# Altium project MAX-F10S-00B Breakout V1.PrjPcb
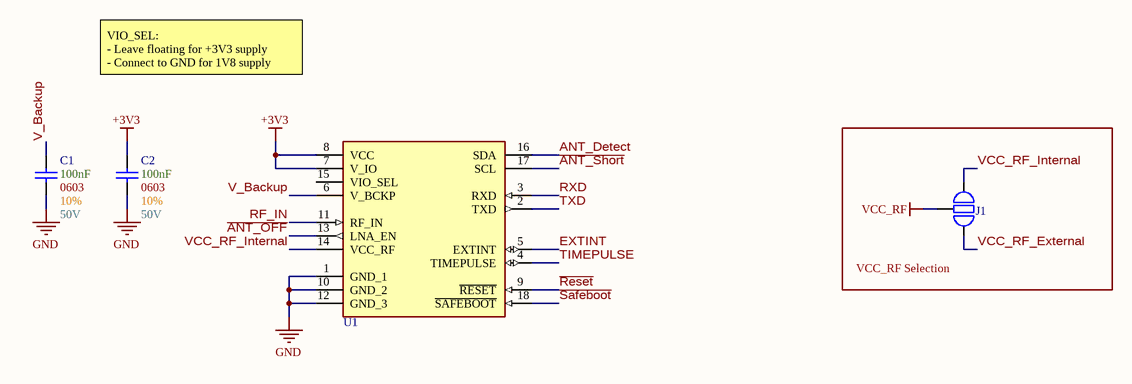
[diagram p0: Main.SchDoc]
3 sheets, 25 parts. Net scope: global (net labels, ports and power ports of the same name join across sheets).
Board file: Layout.PcbDoc
Sheets:
  Main.SchDoc
  Antenna Supervisory Circuit.SchDoc
  Power.SchDoc

## Sheet Main.SchDoc
size A; SheetNumber: 1; SheetTotal: 4

### Parts
C1  Max Voltage: 50V  Size Package: 0603  Tolerance: 10%  Capacitance: 100nF  [[Cap] SMD 0603]  (hidden comment: [Cap] 0603 0.1uF 10% 50V)
C2  Max Voltage: 50V  Size Package: 0603  Tolerance: 10%  Capacitance: 100nF  [[Cap] SMD 0603]  (hidden comment: [Cap] 0603 0.1uF 10% 50V)
J1  [Jumper] Thru-Hole 3pin  [[Jumper] Thru-Hole 3pin]  (value not drawn)  (no BOM)
U1  Dual-Band GNSS Module  [[GNSS] MAX-F10S-00B]  (value not drawn)

### Blocks framed on the sheet
VCC_RF Selection: J1

### Nets
+3V3: C2.2 U1.7(V_IO) U1.8(VCC)
GND: C1.1 C2.1 U1.1(GND_1) U1.10(GND_2) U1.12(GND_3)
RF_IN: U1.11(RF_IN)
VCC_RF: J1.2(Common)
~{ANT_OFF}: U1.13(LNA_EN)
~{ANT_Short}: U1.17(SCL)
~{Reset}: U1.9(~{RESET})
~{Safeboot}: U1.18(~{SAFEBOOT})
ANT_Detect: U1.16(SDA)
EXTINT: U1.5(EXTINT)
RXD: U1.3(RXD)
TIMEPULSE: U1.4(TIMEPULSE)
TXD: U1.2(TXD)
V_Backup: C1.2 U1.6(V_BCKP)
VCC_RF_External: J1.3
VCC_RF_Internal: J1.1 U1.14(VCC_RF)

Not connected (* = marked no-connect by the designer): U1 15(VIO_SEL)

### Notes on the sheet
- VIO_SEL:
  - Leave floating for +3V3 supply
  - Connect to GND for 1V8 supply

### Library data of the parts
C1 C2 = [Cap] 0603 0.1uF 10% 50V: CL10B104KB8NNNC; Supplier 1: DigiKey; Supplier Part Number 1: 1276-1000-6-ND
U1 = [GNSS] MAX-F10S-00B: MAX-F10S-00B

## Sheet Antenna Supervisory Circuit.SchDoc
size A; SheetNumber: 2; SheetTotal: 4
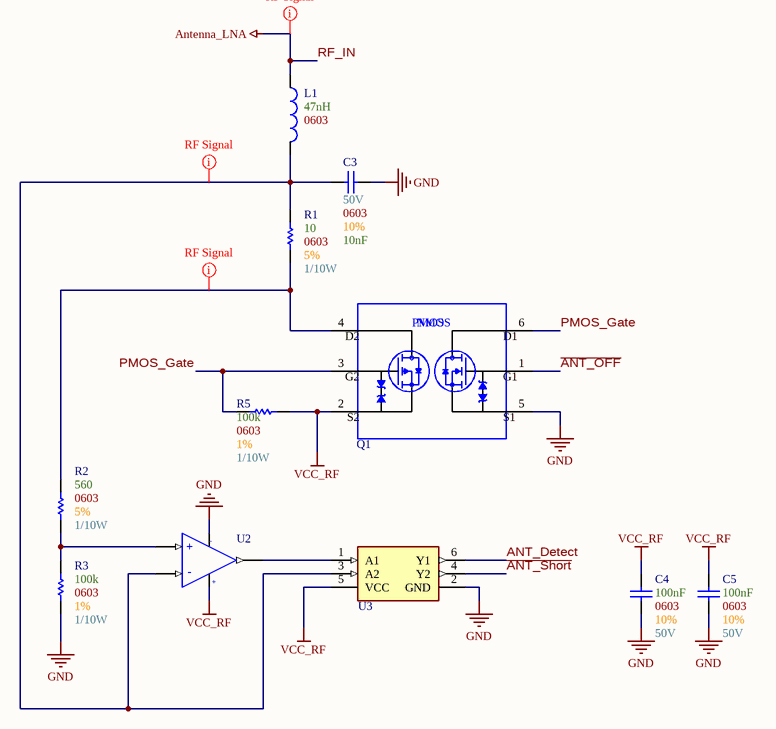
[diagram p1: Antenna Supervisory Circuit.SchDoc]

### Parts
C3  Max Voltage: 50V  Size Package: 0603  Tolerance: 10%  Capacitance: 10nF  [[Cap] SMD 0603]  (hidden comment: [Cap] 0603 0.01uF 10% 50V)
C4  Max Voltage: 50V  Size Package: 0603  Tolerance: 10%  Capacitance: 100nF  [[Cap] SMD 0603]  (hidden comment: [Cap] 0603 0.1uF 10% 50V)
C5  Max Voltage: 50V  Size Package: 0603  Tolerance: 10%  Capacitance: 100nF  [[Cap] SMD 0603]  (hidden comment: [Cap] 0603 0.1uF 10% 50V)
L1  Package: 0603  Inductance: 47nH  [[Inductor] SMD 0603]  (hidden comment: [47nH] SMD 0603 90mA)
Q1  N/PMOS  [SOT-26]  (value not drawn)
R1  Wattage: 1/10W  Tolerance: 5%  Resistance: 10  Size Package: 0603  [[Res] SMD 0603]  (hidden comment: [10] SMD 0603 5% 1/10W)
R2  Wattage: 1/10W  Tolerance: 5%  Resistance: 560  Size Package: 0603  [[Res] SMD 0603]  (hidden comment: [560] SMD 0603 5% 1/10W)
R3  Wattage: 1/10W  Tolerance: 1%  Resistance: 100k  Size Package: 0603  [[Res] SMD 0603]  (hidden comment: [100k] SMD 0603 1% 1/10W)
R5  Wattage: 1/10W  Tolerance: 1%  Resistance: 100k  Size Package: 0603  [[Res] SMD 0603]  (hidden comment: [100k] SMD 0603 1% 1/10W)
U2  [Op-Amp] Rail-to-Rail Vmax=16V GBP=3kHz  [[Op-Amp] Rail-to-Rail Vmax=16V GBP=3kHz]  (value not drawn)
U3  [Buffer] Dual Open Drain  [[Buffer] Dual Open Drain]  (value not drawn)

### Nets
GND: C3.1 C4.1 C5.1 Q1.5(S1) R3.1 U2.2(V-) U3.2(GND)
RF_IN: L1.1  [also labelled Antenna_LNA]
VCC_RF: C4.2 C5.2 Q1.2(S2) R5.1 U2.5(V+) U3.5(VCC)
~{ANT_OFF}: Q1.1(G1)
~{ANT_Short}: U3.4(Y2)
ANT_Detect: U3.6(Y1)
PMOS_Gate: Q1.3(G2) Q1.6(D1) R5.2
NetC3_2: C3.2 L1.2 R1.2 U2.4(-IN) U3.3(A2)
NetQ1_4: Q1.4(D2) R1.1 R2.2
NetR2_1: R2.1 R3.2 U2.3(+IN)
NetU2_1: U2.1(OUT) U3.1(A1)

### Layout directives
net class nRF Signal: NetC3_2, NetQ1_4, RF_IN

### Notes on the sheet
- (in symbol [NMOS, PMOS] FET Array 20V 1.14A) PMOS; NMOS
- (in symbol [Op-Amp] Rail-to-Rail Vmax=16V GBP=3kHz) -; +

### Library data of the parts
C3 = [Cap] 0603 0.01uF 10% 50V: C0603C103K5RACTU; Supplier 1: DigiKey; Supplier Part Number 1: 399-C0603C103K5RACTUDKR-ND
C4 C5 = [Cap] 0603 0.1uF 10% 50V: CL10B104KB8NNNC; Supplier 1: DigiKey; Supplier Part Number 1: 1276-1000-6-ND
L1 = [47nH] SMD 0603 90mA: AIMC-0603-47NJ-T; Supplier 1: DigiKey; Supplier Part Number 1: 535-11541-6-ND
Q1 = [NMOS, PMOS] FET Array 20V 1.14A: DMC2700UDM-7; Supplier 1: DigiKey; Supplier Part Number 1: DMC2700UDM-7DKR-ND
R1 = [10] SMD 0603 5% 1/10W: RC0603JR-1310RL; Supplier 1: DigiKey; Supplier Part Number 1: 13-RC0603JR-1310RLDKR-ND
R2 = [560] SMD 0603 5% 1/10W: RC0603JR-07560RL; Supplier 1: DigiKey; Supplier Part Number 1: 311-560GRDKR-ND
R3 R5 = [100k] SMD 0603 1% 1/10W: RC0603FR-07100KL; Supplier 1: DigiKey; Supplier Part Number 1: 311-100KHRDKR-ND
U2 = [Op-Amp] Rail-to-Rail Vmax=16V GBP=3kHz: LT6003CS5#TRMPBF; Supplier 1: DigiKey; Supplier Part Number 1: 505-LT6003CS5#TRMPBFCT-ND
U3 = [Buffer] Dual Open Drain: NC7WZ07P6X; Supplier 1: DigiKey; Supplier Part Number 1: NC7WZ07P6XDKR-ND

## Sheet Power.SchDoc
size A; SheetNumber: 3; SheetTotal: 4
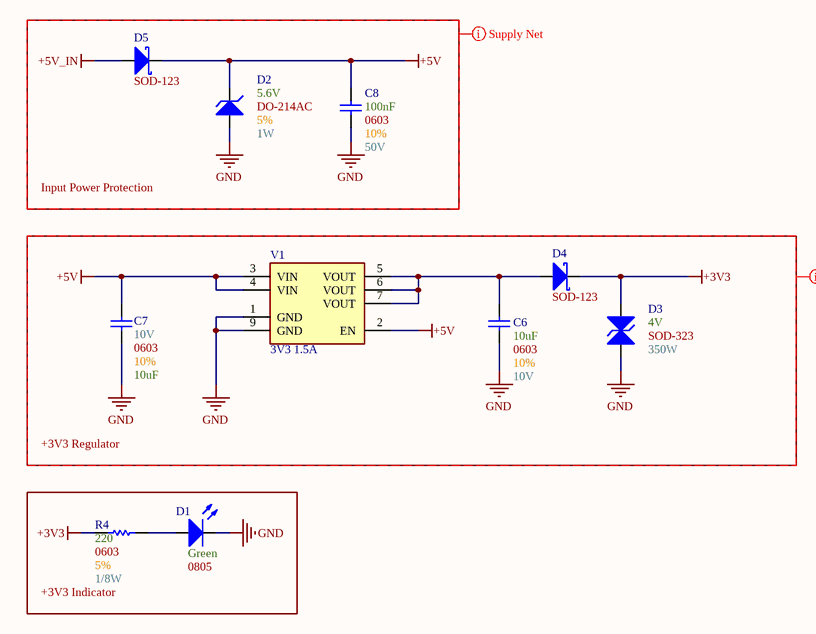
[diagram p2: Power.SchDoc]

### Parts
C6  Max Voltage: 10V  Size Package: 0603  Tolerance: 10%  Capacitance: 10uF  [[Cap] SMD 0603]  (hidden comment: [Cap] 0603 10uF 10% 10V)
C7  Max Voltage: 10V  Size Package: 0603  Tolerance: 10%  Capacitance: 10uF  [[Cap] SMD 0603]  (hidden comment: [Cap] 0603 10uF 10% 10V)
C8  Max Voltage: 50V  Size Package: 0603  Tolerance: 10%  Capacitance: 100nF  [[Cap] SMD 0603]  (hidden comment: [Cap] 0603 0.1uF 10% 50V)
D1  Color: Green  Size Package: 0805  [[LED] SMD 0805]  (hidden comment: [LED] SMD 0805 Green)
D2  Tolerance: 5%  Wattage: 1W  Optimal Zener Voltage: 5.6V  [[Diode] SMD DO-214AC]  (hidden comment: DO-214AC)
D3  Wattage: 350W  Optimal Zener Voltage: 4V  [[Diode] SOD-323]  (hidden comment: SOD-323)
D4  Footprint: SOD-123  [[Diode] SMD SOD-123]  (hidden comment: SOD123)
D5  Footprint: SOD-123  [[Diode] SMD SOD-123]  (hidden comment: SOD123)
R4  Wattage: 1/8W  Tolerance: 5%  Resistance: 220  Size Package: 0603  [[Res] SMD 0603]  (hidden comment: [220] SMD 0603 5% 1/10W)
V1  3V3 1.5A  [[Linear] 3V3 1.5A]

### Blocks framed on the sheet
Input Power Protection: C8 D2 D5
+3V3 Regulator: C6 C7 D3 D4 V1
+3V3 Indicator: D1 R4

### Nets
+3V3: D3.1(K) D4.1(K) R4.1
+5V: C7.2 C8.2 D2.1(K) D5.1(K) V1.2(EN) V1.3(VIN) V1.4(VIN)
+5V_IN: D5.2(A)
GND: C6.1 C7.1 C8.1 D1.2(Cathode) D2.2(A) D3.2(A) V1.1(GND) V1.9(GND)
NetC6_2: C6.2 D4.2(A) V1.5(VOUT) V1.6(VOUT) V1.7(VOUT)
NetD1_1: D1.1(Anode) R4.2

### Layout directives
net class Supply_Nets: +3V3, +5V, +5V_IN, GND

### Library data of the parts
C6 C7 = [Cap] 0603 10uF 10% 10V: CL10A106KP8NNNC; Supplier 1: DigiKey; Supplier Part Number 1: 1276-1192-6-ND
C8 = [Cap] 0603 0.1uF 10% 50V: CL10B104KB8NNNC; Supplier 1: DigiKey; Supplier Part Number 1: 1276-1000-6-ND
D1 = [LED] SMD 0805 Green: LG R971-KN-1-0-20-R18; Supplier 1: DigiKey; Supplier Part Number 1: 475-LGR971-KN-1CT-ND
D2 = [Zener] SMD 5.6V 1W 5%: SMAZ5V6-13-F; Supplier 1: DigiKey; Supplier Part Number 1: SMAZ5V6-FDICT-ND; Footprint: DO-214AC
D3 = [TVS] 3.3Vnom 19Vclamp_max: CDSOD323-T03C; Supplier 1: DigiKey; Footprint: SOD-323; Supplier Part Number 1: CDSOD323-T03CDKR-ND
D4 D5 = [Schottky] SMD 40V 1A: B5819W-TP; Supplier 1: DigiKey; Supplier Part Number 1: B5819W-TPMSCT-ND
R4 = [220] SMD 0603 5% 1/10W: RK73B1JTTD221J; Supplier 1: DigiKey; Supplier Part Number 1: 2019-RK73B1JTTD221JDKR-ND
V1 = [Linear] SMD 3V3 1.5A: AP7362A-33SP-13; Supplier 1: DigiKey; Supplier Part Number 1: AP7362A-33SP-13DICT-ND

## Nets that join several sheets
+3V3: Main (C2.2 U1.7 U1.8), Power (D3.1 D4.1 R4.1)
GND: Main (5 pins), Antenna Supervisory Circuit (7 pins), Power (8 pins)
RF_IN: Main (U1.11), Antenna Supervisory Circuit (L1.1)
VCC_RF: Main (J1.2), Antenna Supervisory Circuit (6 pins)
~{ANT_OFF}: Main (U1.13), Antenna Supervisory Circuit (Q1.1)
~{ANT_Short}: Main (U1.17), Antenna Supervisory Circuit (U3.4)
ANT_Detect: Main (U1.16), Antenna Supervisory Circuit (U3.6)